# Altium project B&D-A PFC.PrjPcb
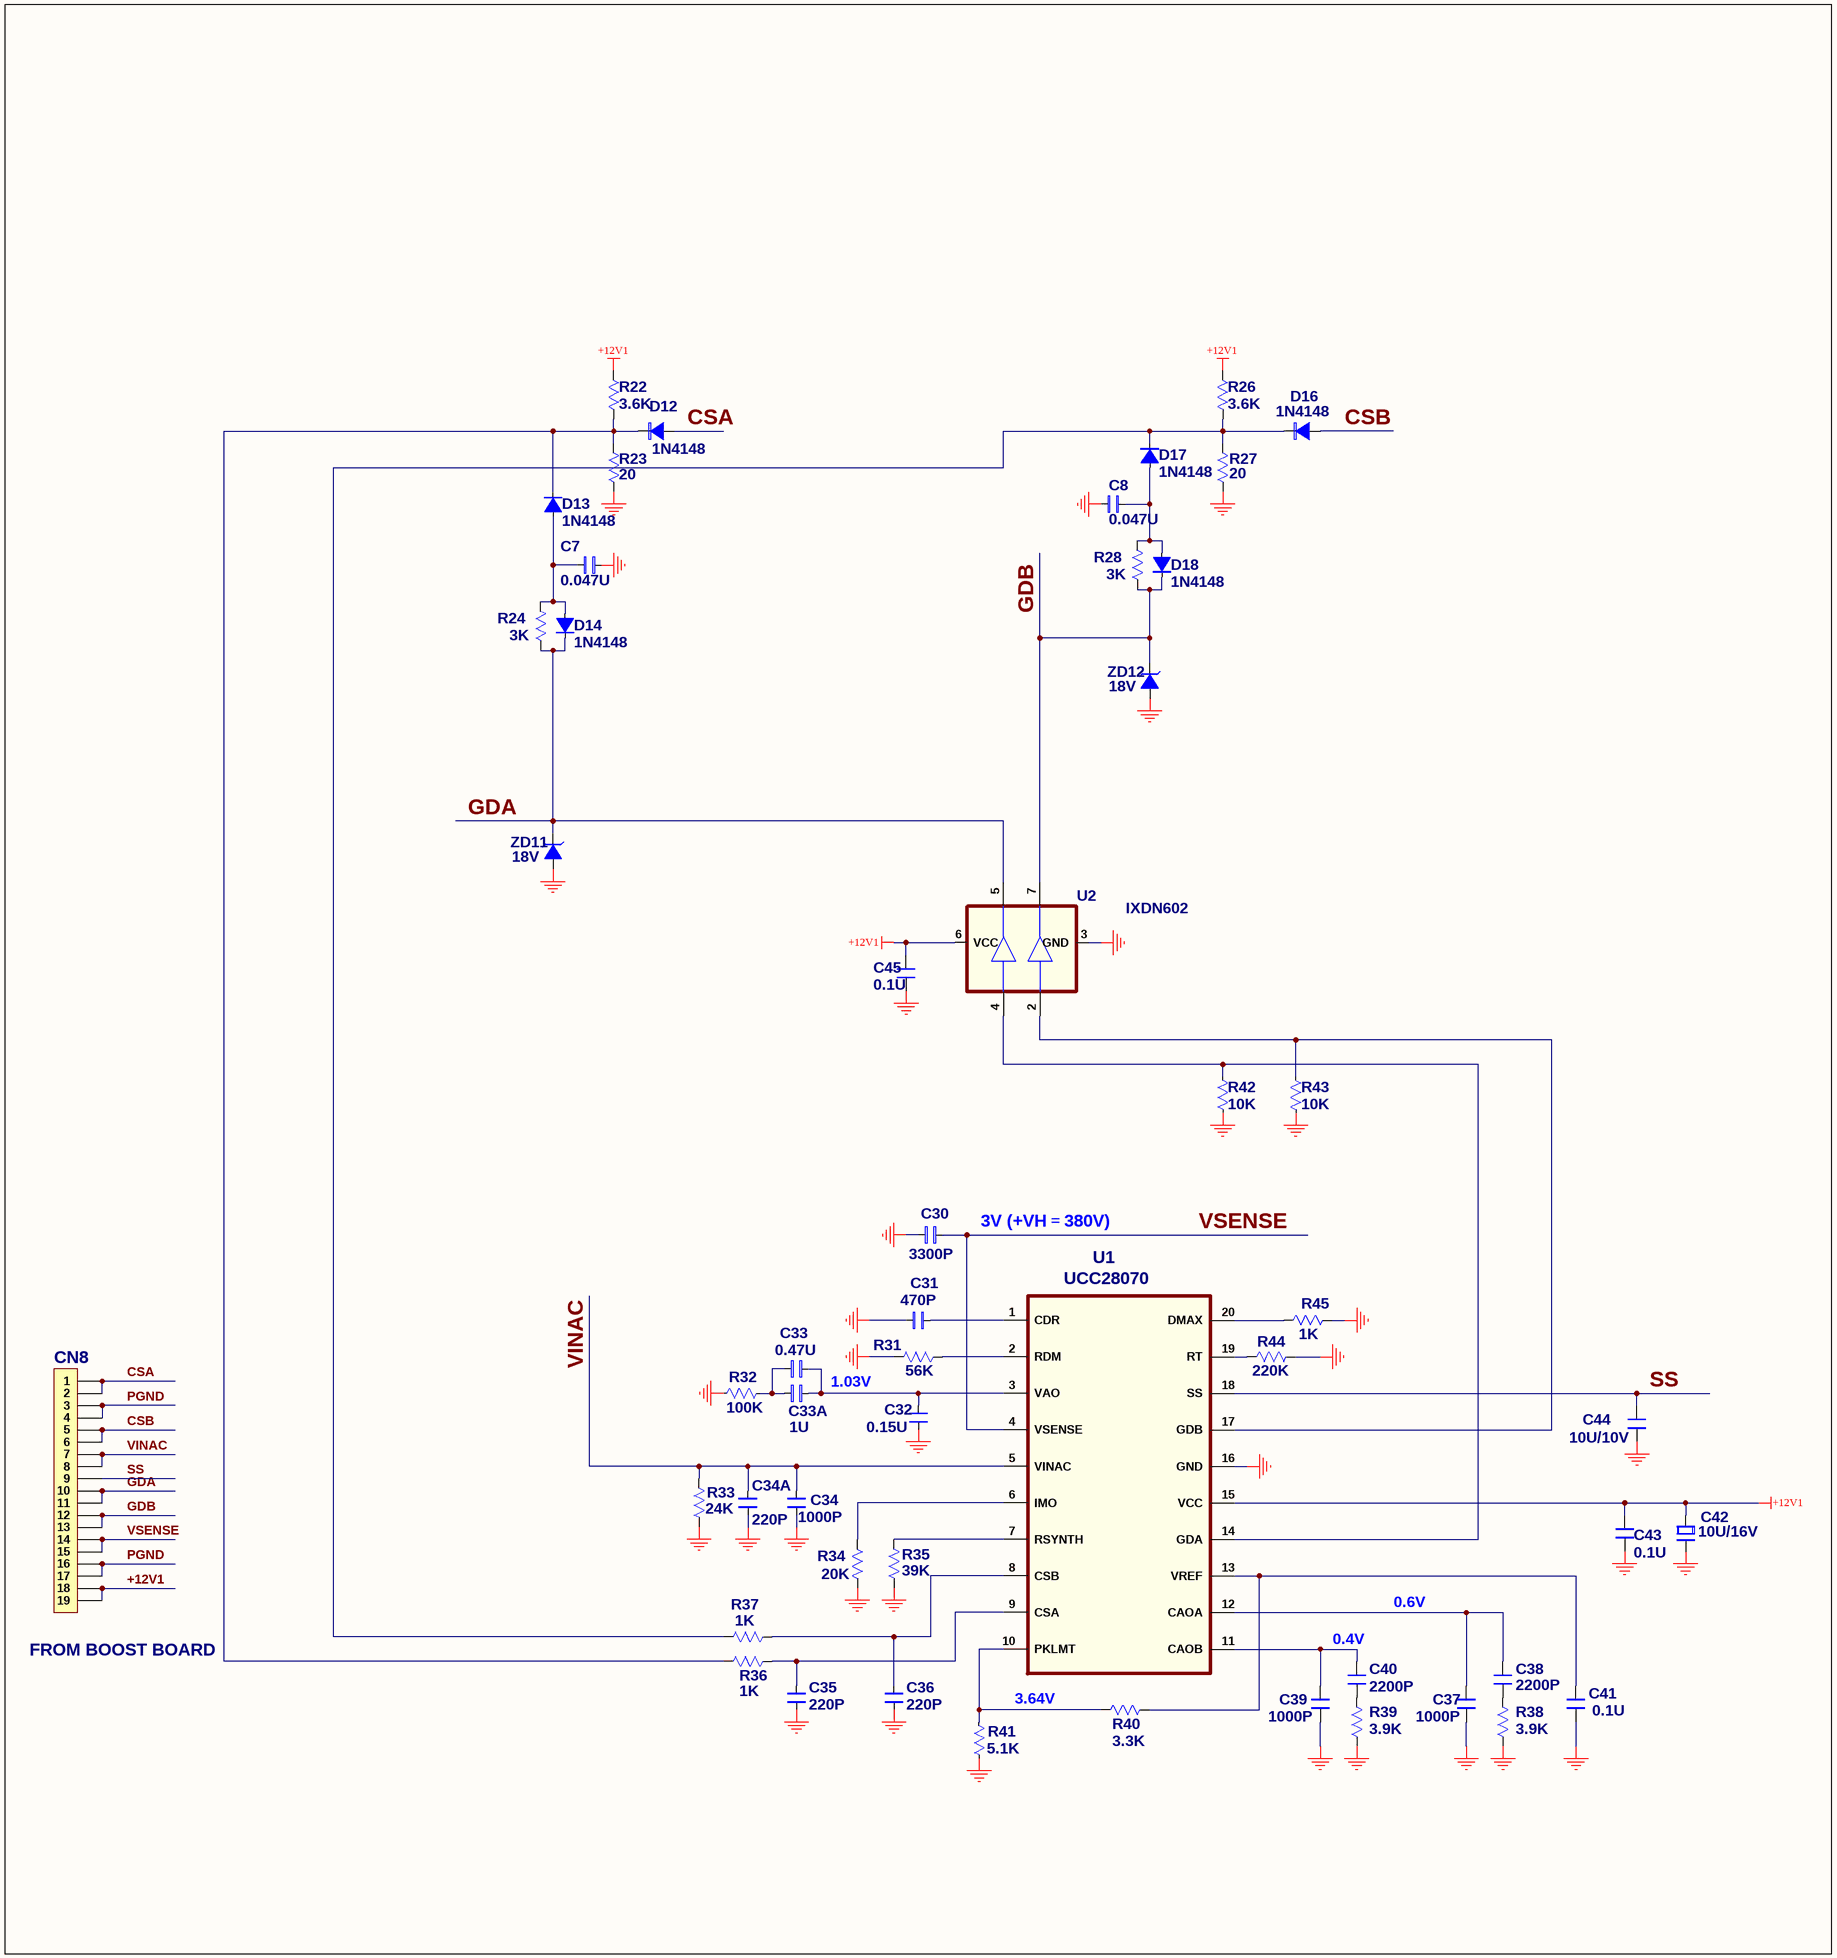
[diagram p0: B&D PFC.SchDoc]
1 sheet, 52 parts. Net scope: global (net labels, ports and power ports of the same name join across sheets).
Board file: B&D PFC.PcbDoc

## Sheet B&D PFC.SchDoc
size 381 x 406 mm; SheetNumber: 0; SheetTotal: 0

### Parts
C7  0.047U  [2012(0805)-2.54]
C8  0.047U  [2012(0805)-2.54]
C30  3300P  [2012(0805)-2.54]
C31  470P  [2012(0805)-2.54]
C32  0.15U  [2012(0805)-2.54]
C33  0.47U  [2012(0805)-2.54]
C33A  1U  [2012(0805)-2.54]
C34  1000P  [2012(0805)-2.54]
C34A  220P  [2012(0805)-2.54]
C35  220P  [2012(0805)-2.54]
C36  220P  [2012(0805)-2.54]
C37  1000P  [2012(0805)-2.54]
C38  2200P  [2012(0805)-2.54]
C39  1000P  [2012(0805)-2.54]
C40  2200P  [2012(0805)-2.54]
C41  0.1U  [2012(0805)-2.54]
C42  10U/16V  [CAP P 3528]
C43  0.1U  [2012(0805)-2.54]
C44  10U/10V  [3216(1206)-3.05]
C45  0.1U  [2012(0805)-2.54]
CN8  PIN HDR 1*19-90  [PIN HDR 1*19-90]  (value not drawn)
D12  1N4148  [D3515]
D13  1N4148  [D3515]
D14  1N4148  [D3515]
D16  1N4148  [D3515]
D17  1N4148  [D3515]
D18  1N4148  [D3515]
R22  3.6K  [2012(0805)-2.54]
R23  20  [2012(0805)-2.54]
R24  3K  [2012(0805)-2.54]
R26  3.6K  [2012(0805)-2.54]
R27  20  [2012(0805)-2.54]
R28  3K  [2012(0805)-2.54]
R31  56K  [2012(0805)-2.54]
R32  100K  [2012(0805)-2.54]
R33  24K  [2012(0805)-2.54]
R34  20K  [2012(0805)-2.54]
R35  39K  [2012(0805)-2.54]
R36  1K  [2012(0805)-2.54]
R37  1K  [2012(0805)-2.54]
R38  3.9K  [2012(0805)-2.54]
R39  3.9K  [2012(0805)-2.54]
R40  3.3K  [2012(0805)-2.54]
R41  5.1K  [2012(0805)-2.54]
R42  10K  [2012(0805)-2.54]
R43  10K  [2012(0805)-2.54]
R44  220K  [2012(0805)-2.54]
R45  1K  [2012(0805)-2.54]
U1  UCC28070  [TSSOP20-240-0.65]
U2  IXDN602  [SO8-240-1.27]
ZD11  18V  [DZ3515-3.56]
ZD12  18V  [DZ3515-3.56]

### Nets
+12V1: C42.1 C43.1 C45.1 CN8.18 CN8.19 R22.1 R26.1 U1.15(VCC) U2.6(VCC)
PGND: C7.2 C8.2 C30.1 C31.1 C32.1 C34.2 C34A.2 C35.2 C36.2 C37.2 C39.1 C41.1 C42.2 C43.2 C44.1 C45.2 CN8.3 CN8.4 CN8.16 CN8.17 R23.1 R27.1 R31.2 R32.1 R33.1 R34.2 R35.1 R38.1 R39.1 R41.1 R42.1 R43.2 R44.2 R45.2 U1.16(GND) U2.3(GND) ZD11.1(A) ZD12.1(A)
CSA: CN8.1 CN8.2 D12.1(A)
CSB: CN8.5 CN8.6 D16.1(A)
GDA: CN8.10 CN8.11 D14.2(K) R24.1 U2.5(OUTB) ZD11.2(K)
GDB: CN8.12 CN8.13 D18.2(K) R28.1 U2.7(OUTA) ZD12.2(K)
SS: C44.2 CN8.9 U1.18(SS)
VINAC: C34.1 C34A.1 CN8.7 CN8.8 R33.2 U1.5(VINAC)
VSENSE: C30.2 CN8.14 CN8.15 U1.4(VSENSE)
NetC7_1: C7.1 D13.1(A) D14.1(A) R24.2
NetC8_1: C8.1 D17.1(A) D18.1(A) R28.2
NetC31_2: C31.2 U1.1(CDR)
NetC32_2: C32.2 C33.2 C33A.2 U1.3(VAO)
NetC33_1: C33.1 C33A.1 R32.2
NetC35_1: C35.1 R36.1 U1.9(CSA)
NetC36_1: C36.1 R37.1 U1.8(CSB)
NetC37_1: C37.1 C38.2 U1.12(CAOA)
NetC38_1: C38.1 R38.2
NetC39_2: C39.2 C40.2 U1.11(CAOB)
NetC40_1: C40.1 R39.2
NetC41_2: C41.2 R40.2 U1.13(VREF)
NetD12_2: D12.2(K) D13.2(K) R22.2 R23.2 R36.2
NetD16_2: D16.2(K) D17.2(K) R26.2 R27.2 R37.2
NetR31_1: R31.1 U1.2(RDM)
NetR34_1: R34.1 U1.6(IMO)
NetR35_2: R35.2 U1.7(RSYNTH)
NetR40_1: R40.1 R41.2 U1.10(PKLMT)
NetR42_2: R42.2 U1.14(GDA) U2.4(INB)
NetR43_1: R43.1 U1.17(GDB) U2.2(INA)
NetR44_1: R44.1 U1.19(RT)
NetR45_1: R45.1 U1.20(DMAX)

### Notes on the sheet
- (near C30) 3V (+VH＝380V)
- 1.03V
- 0.6V
- (near CN8) FROM BOOST BOARD
- (near C40) 0.4V
- 3.64V

### Library data of the parts
C7 C8 C30-C33 C33A C34 C34A C35 C36 = CAP_2: Capacitor
C37-C41 C43-C45 = CAP_3: Capacitor
C42 = CAP P_3: Electrolytic Capacitor
CN8 = CON19: Connector
D12 D16 = DIODE(AK)_2: Diode
D13 D14 D17 D18 = DIODE(AK)_1: Diode
R22-R24 R26-R28 R31 R33-R40 R44 R45 = RES_2: Resistor
R32 R41-R43 = RES_1: Resistor
U1 = UCC28070_1
U2 = IXDN602_3: Ultrafast MOSFET Drivers
ZD11 ZD12 = ZD_2: Zener Diode